# EAGLE design main (EAGLE 9.5.2)
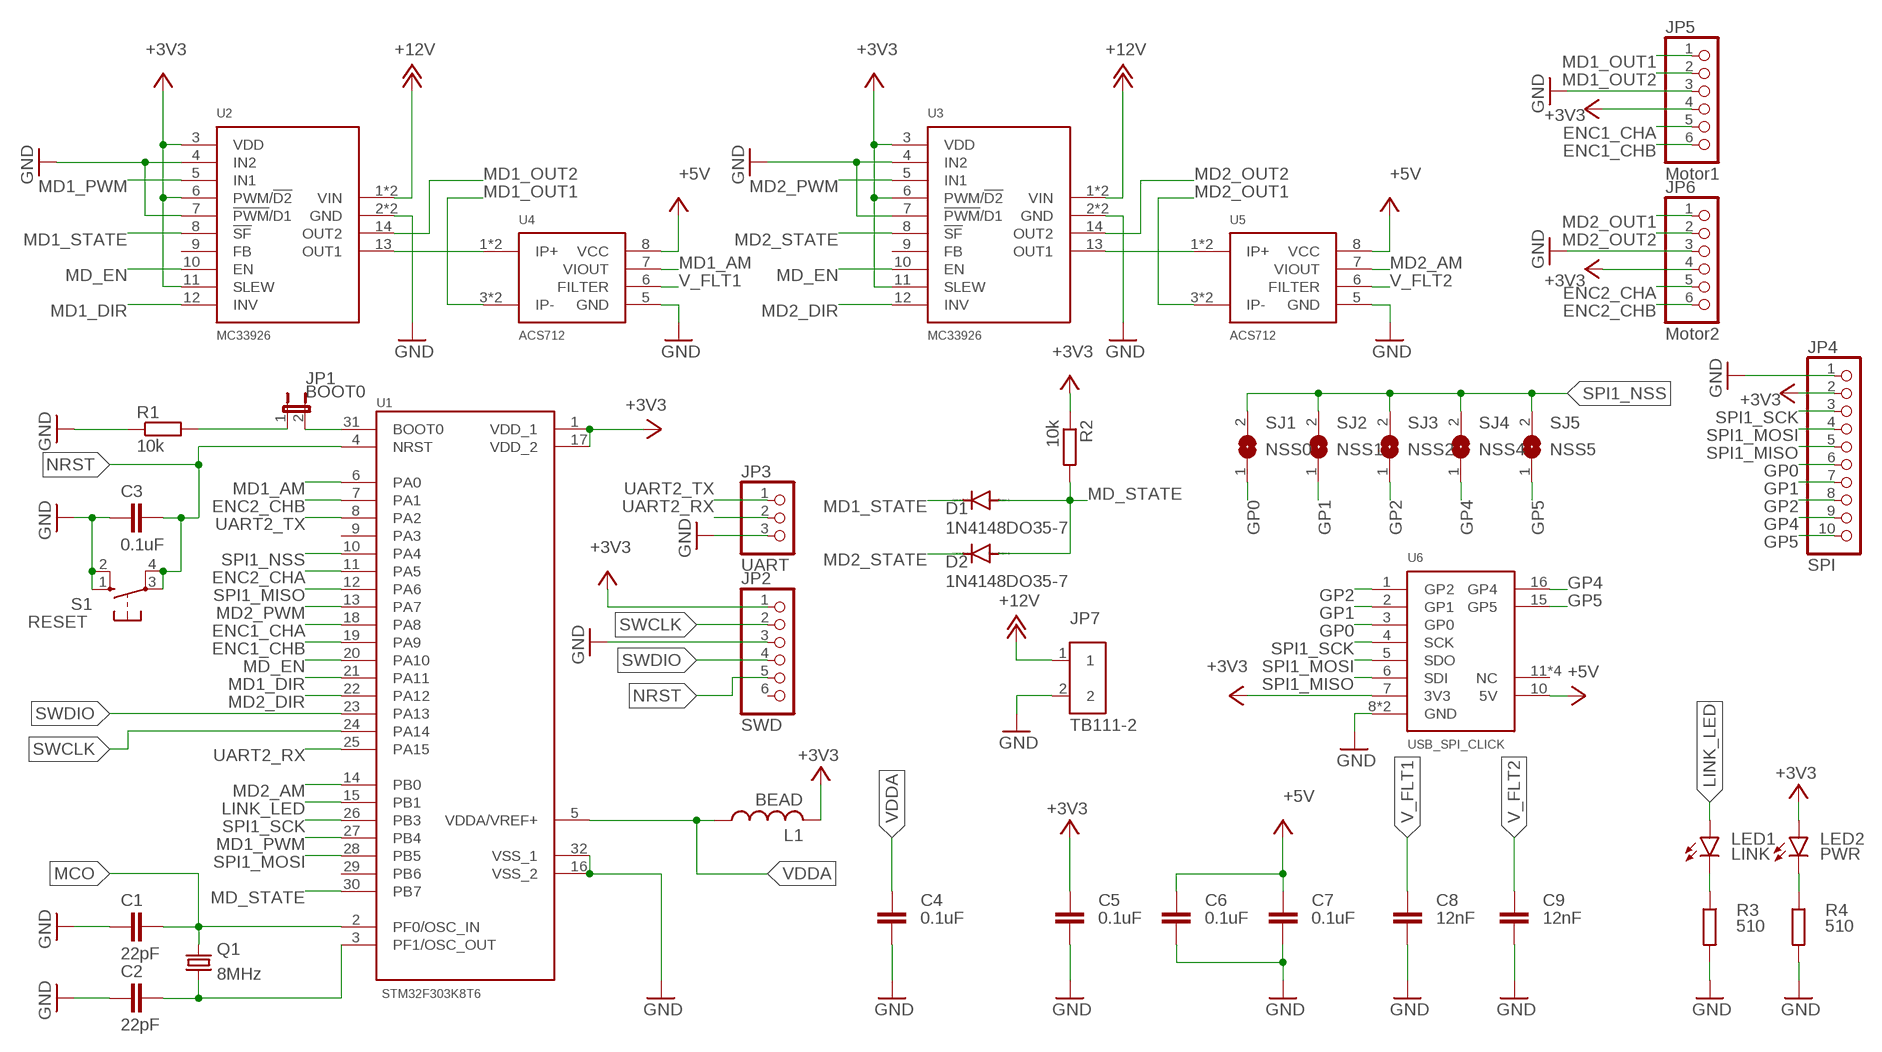
[diagram p0: schematic, sheet 1]

## Parts
C1  22pF  C-EUC1608  [C1608]
C2  22pF  C-EUC1608  [C1608]
C3  0.1uF  C-EUC1608  [C1608]
C4  0.1uF  C-EUC1608  [C1608]
C5  0.1uF  C-EUC1608  [C1608]
C6  0.1uF  C-EUC1608  [C1608]
C7  0.1uF  C-EUC1608  [C1608]
C8  12nF  C-EUC1608  [C1608]
C9  12nF  C-EUC1608  [C1608]
D1  1N4148DO35-7  [DO35-7]
D2  1N4148DO35-7  [DO35-7]
JP1  BOOT0  JP1E  [JP1]
JP2  SWD  PINHD-1X6  [1X06]
JP3  UART  PINHD-1X3  [1X03]
JP4  SPI  PINHD-1X10  [1X10]
JP5  Motor1  PINHD-1X6/90  [1X06/90]
JP6  Motor2  PINHD-1X6/90  [1X06/90]
JP7  TB111-2  P-01306_TB111-2-2-U-1-1  [TB111-2-2-U-1-1]
L1  BEAD  L-USL2012C  [L2012C]
LED1  LINK  LED3MM  [LED3MM]
LED2  PWR  LED3MM  [LED3MM]
Q1  8MHz  CRYSTALHC49S  [HC49/S]
R1  10k  R-EU_R1210  [R1210]
R2  10k  R-EU_R1210  [R1210]
R3  510  R-EU_R1210  [R1210]
R4  510  R-EU_R1210  [R1210]
S1  RESET  10-XX  [B3F-10XX]
SJ1  NSS0  SJ  [SJ]
SJ2  NSS1  SJ  [SJ]
SJ3  NSS2  SJ  [SJ]
SJ4  NSS4  SJ  [SJ]
SJ5  NSS5  SJ  [SJ]
U1  STM32F303K8T6  [QFP80P900X900X160-32N]
U2  MC33926  [SINGLE]
U3  MC33926  [SINGLE]
U4  ACS712  [SOIC8]
U5  ACS712  [SOIC8]
U6  USB_SPI_CLICK  [MIKROBUS]

## Nets
+3V3 [+3v3]: C5.1 JP2.1 JP4.2 JP5.4 JP6.4 L1.2 LED2.A R2.1 U1.1(VDD_1) U1.17(VDD_2) U2.3(VDD) U2.6(PWM/!D2!) U2.11(SLEW) U3.3(VDD) U3.6(PWM/!D2!) U3.11(SLEW) U6.7(3V3)
+5V [+5v]: C6.1 C7.1 U4.8(VCC) U5.8(VCC) U6.10(5V)
+12V [+12v]: JP7.1 U2.1(VIN) U2.16(VIN) U3.1(VIN) U3.16(VIN)
ENC1_CHA: JP5.5 U1.18(PA8)
ENC1_CHB: JP5.6 U1.19(PA9)
ENC2_CHA: JP6.5 U1.11(PA5)
ENC2_CHB: JP6.6 U1.7(PA1)
GND [gnd]: C1.2 C2.2 C3.1 C4.2 C5.2 C6.2 C7.2 C8.2 C9.2 JP2.3 JP3.3 JP4.1 JP5.3 JP6.3 JP7.2 R1.1 R3.2 R4.2 S1.1(S) S1.2(S1) U1.16(VSS_2) U1.32(VSS_1) U2.2(GND) U2.4(IN2) U2.7(!PWM!/D1) U2.15(GND) U3.2(GND) U3.4(IN2) U3.7(!PWM!/D1) U3.15(GND) U4.5(GND) U5.5(GND) U6.8(GND) U6.9(GND)
GP0: JP4.6 SJ1.1 U6.3(GP0)
GP1: JP4.7 SJ2.1 U6.2(GP1)
GP2: JP4.8 SJ3.1 U6.1(GP2)
GP4: JP4.9 SJ4.1 U6.16(GP4)
GP5: JP4.10 SJ5.1 U6.15(GP5)
LINK_LED: LED1.A U1.15(PB1)
MCO [clock]: C1.1 Q1.2 U1.2(PF0/OSC_IN)
MD1_AM [analog]: U1.6(PA0) U4.7(VIOUT)
MD1_DIR: U1.21(PA11) U2.12(INV)
MD1_OUT1 [+12v]: JP5.1 U4.3(IP-) U4.4(IP-)
MD1_OUT2 [+12v]: JP5.2 U2.14(OUT2)
MD1_PWM: U1.27(PB4) U2.5(IN1)
MD1_STATE: D1.C U2.8(!SF!)
MD2_AM [analog]: U1.14(PB0) U5.7(VIOUT)
MD2_DIR: U1.22(PA12) U3.12(INV)
MD2_OUT1 [+12v]: JP6.1 U5.3(IP-) U5.4(IP-)
MD2_OUT2 [+12v]: JP6.2 U3.14(OUT2)
MD2_PWM: U1.13(PA7) U3.5(IN1)
MD2_STATE: D2.C U3.8(!SF!)
MD_EN: U1.20(PA10) U2.10(EN) U3.10(EN)
MD_STATE: D1.A D2.A R2.2 U1.30(PB7)
N$1: JP1.2 U1.31(BOOT0)
N$2 [clock]: C2.1 Q1.1 U1.3(PF1/OSC_OUT)
N$3: JP1.1 R1.2
N$4 [+12v]: U2.13(OUT1) U4.1(IP+) U4.2(IP+)
N$5 [+12v]: U3.13(OUT1) U5.1(IP+) U5.2(IP+)
N$11: LED1.K(C) R3.1
N$12: LED2.K(C) R4.1
NRST: C3.2 JP2.5 S1.3(P) S1.4(P1) U1.4(NRST)
SPI1_MISO: JP4.5 U1.12(PA6) U6.6(SDI)
SPI1_MOSI: JP4.4 U1.28(PB5) U6.5(SDO)
SPI1_NSS: SJ1.2 SJ2.2 SJ3.2 SJ4.2 SJ5.2 U1.10(PA4)
SPI1_SCK: JP4.3 U1.26(PB3) U6.4(SCK)
SWCLK: JP2.2 U1.24(PA14)
SWDIO: JP2.4 U1.23(PA13)
UART2_RX: JP3.2 U1.25(PA15)
UART2_TX: JP3.1 U1.8(PA2)
V_FLT1: C8.1 U4.6(FILTER)
V_FLT2: C9.1 U5.6(FILTER)
VDDA [+3v3]: C4.1 L1.1 U1.5(VDDA/VREF+)
Unconnected: JP2.6 U1.9(PA3) U1.29(PB6) U2.9(FB) U3.9(FB) U6.11(NC) U6.12(NC) U6.13(NC) U6.14(NC)

## Library data of the parts
C1-C9 = rcl:C-EU: CAPACITOR, European symbol; SPICEPREFIX: C
D1 D2 = diode:1N4148: DIODE high speed (Philips)
JP1 = jumper:JP1E: JUMPER
JP2 JP5 JP6 = pinhead:PINHD-1X6: PIN HEADER
JP3 = pinhead:PINHD-1X3: PIN HEADER
JP4 = pinhead:PINHD-1X10: PIN HEADER
JP7 = Akizuki:P-01306_TB111-2-2-U-1-1
L1 = rcl:L-US: INDUCTOR, American symbol; SPICEPREFIX: L
LED1 LED2 = led:LED: LED OSRAM: - CHIPLED LG R971, LG N971, LY N971, LG Q971, LY Q971, LO R971, LY R971 LH N974, LH R974 LS Q976, LO Q976, LY Q976 LO Q996 - Hyper CHIPLED LW Q18S LB Q993, LB Q99A, LB R99A - SideLED LS A670, LO A670, LY A670, LG A670, LP A670 LB A673, LV A673, LT A673, LW A673 LH A674 LY A675 LS A676, LA A676, LO A676, LY A676, LW A676 LS A679, LY A679, LG A679 - Hyper Micro SIDELED® LS Y876, LA Y876, LO Y876, LY Y876 LT Y87S - SmartLED LW L88C, LW L88S LB L89C, LB L89S, LG L890 LS L89K, LO L89K, LY L89K LS L896, LA L896, LO L896, LY L896 - TOPLED LS T670, LO T670, LY T670, LG T670, LP T670 LSG T670, LSP T670, LSY T670, LOP T670, LYG T670 LG T671, LOG T671, LSG T671 LB T673, LV T673, LT T673, LW T673 LH T674 LS T676, LA T676, LO T676, LY T676, LB T676, LH T676, LSB T676, LW T676 LB T67C, LV T67C, LT T67C, LS T67K, LO T67K, LY T67K, LW E67C LS E67B, LA E67B, LO E67B, LY E67B, LB E67C, LV E67C, LT E67C LW T67C LS T679, LY T679, LG T679 LS T770, LO T770, LY T770, LG T770, LP T770 LB T773, LV T773, LT T773, LW T773 LH T774 LS E675, LA E675, LY E675, LS T675 LS T776, LA T776, LO T776, LY T776, LB T776 LHGB T686 LT T68C, LB T68C - Hyper Mini TOPLED® LB M676 - Mini TOPLED Santana® LG M470 LS M47K, LO M47K, LY M47K Source: http://www.osram.convergy.de LUXEON: - LUMILED® LXK2-PW12-R00, LXK2-PW12-S00, LXK2-PW14-U00, LXK2-PW14-V00 LXK2-PM12-R00, LXK2-PM12-S00, LXK2-PM14-U00 LXK2-PE12-Q00, LXK2-PE12-R00, LXK2-PE12-S00, LXK2-PE14-T00, LXK2-PE14-U00 LXK2-PB12-K00, LXK2-PB12-L00, LXK2-PB12-M00, LXK2-PB14-N00, LXK2-PB14-P00, LXK2-PB14-Q00 LXK2-PR12-L00, LXK2-PR12-M00, LXK2-PR14-Q00, LXK2-PR14-R00 LXK2-PD12-Q00, LXK2-PD12-R00, LXK2-PD12-S00 LXK2-PH12-R00, LXK2-PH12-S00 LXK2-PL12-P00, LXK2-PL12-Q00, LXK2-PL12-R00 Source: www.luxeon.com KINGBRIGHT: KA-3528ASYC Source: www.kingbright.com
Q1 = crystal:CRYSTAL: CRYSTAL; OC_FARNELL: 1667008; OC_NEWARK: unknown
R1-R4 = rcl:R-EU_: RESISTOR, European symbol; SPICEPREFIX: R
S1 = switch-omron:10-XX: OMRON SWITCH; MPN: B3F-1000; OC_FARNELL: 176432; OC_NEWARK: 36M3542
SJ1-SJ5 = jumper:SJ: SMD solder JUMPER
U1 = STM32F303K8T6:STM32F303K8T6: Analog and DSP with FPU ARM Cortex-M4 MCU with 64 Kbytes Flash, 72 MHz CPU, CCM, 12-bit ADC 5 MSPS, comparators, op-amp Check prices <https://pricing.snapeda.com/parts/STM32F303K8T6/STMicroelectronics/view-part?ref=eda>; AVAILABILITY: In Stock; DESCRIPTION: ARM® Cortex®-M4 STM32F3 Microcontroller IC 32-Bit 72MHz 64KB (64K x 8) FLASH 32-LQFP (7x7); MF: STMicroelectronics; MP: STM32F303K8T6; PACKAGE: LQFP-32 STMicroelectronics; PRICE: None; PURCHASE-URL: https://pricing.snapeda.com/search/part/STM32F303K8T6/?ref=eda
U2 U3 = pololu_mc33926:MC33926
U4 U5 = ACS712:ACS712
U6 = USB_SPI_Click:USB_SPI_CLICK

## Net classes
0 default: width 0.305 mm, drill 0.305 mm, clearance 0.178 mm
1 +5v: width 0.381 mm, drill 0.381 mm, clearance 0.203 mm
2 +3v3: width 0.381 mm, drill 0.381 mm, clearance 0.203 mm
3 +12v: width 1.016 mm, drill 0.889 mm, clearance 0.229 mm
4 analog: width 0.305 mm, drill 0.305 mm, clearance 0.203 mm
5 clock: width 0.305 mm, drill 0.305 mm, clearance 0.203 mm
6 gnd: width 0.406 mm, drill 0.406 mm

## Board
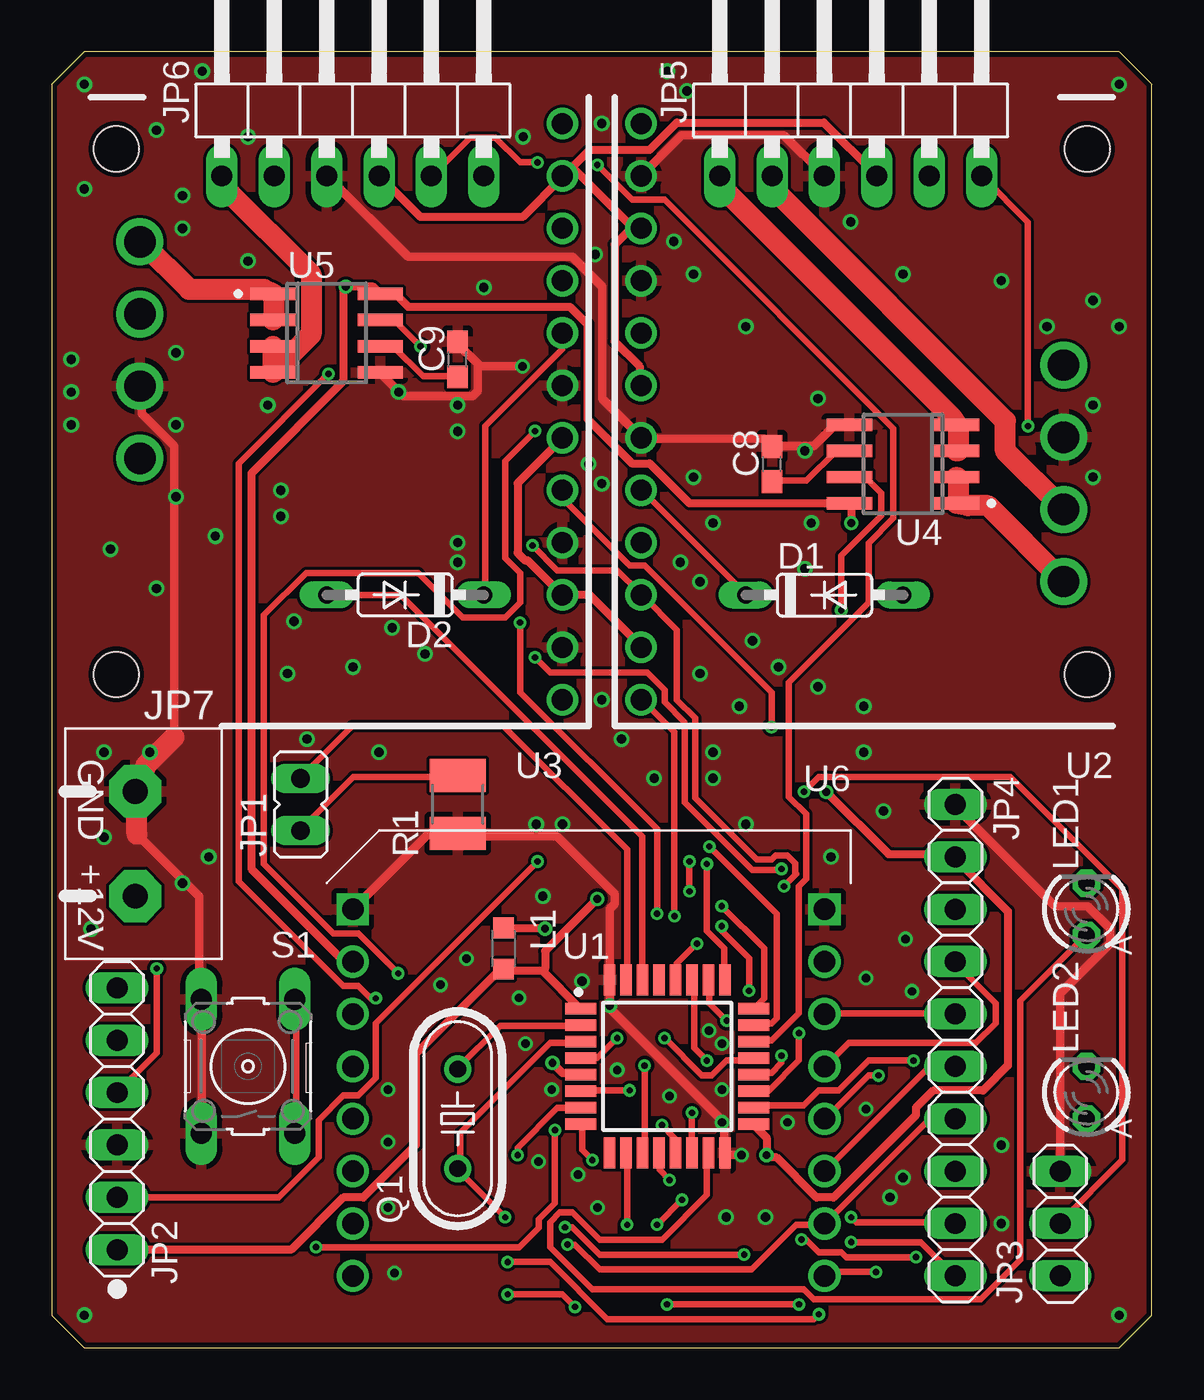
[diagram p1: board, top side]
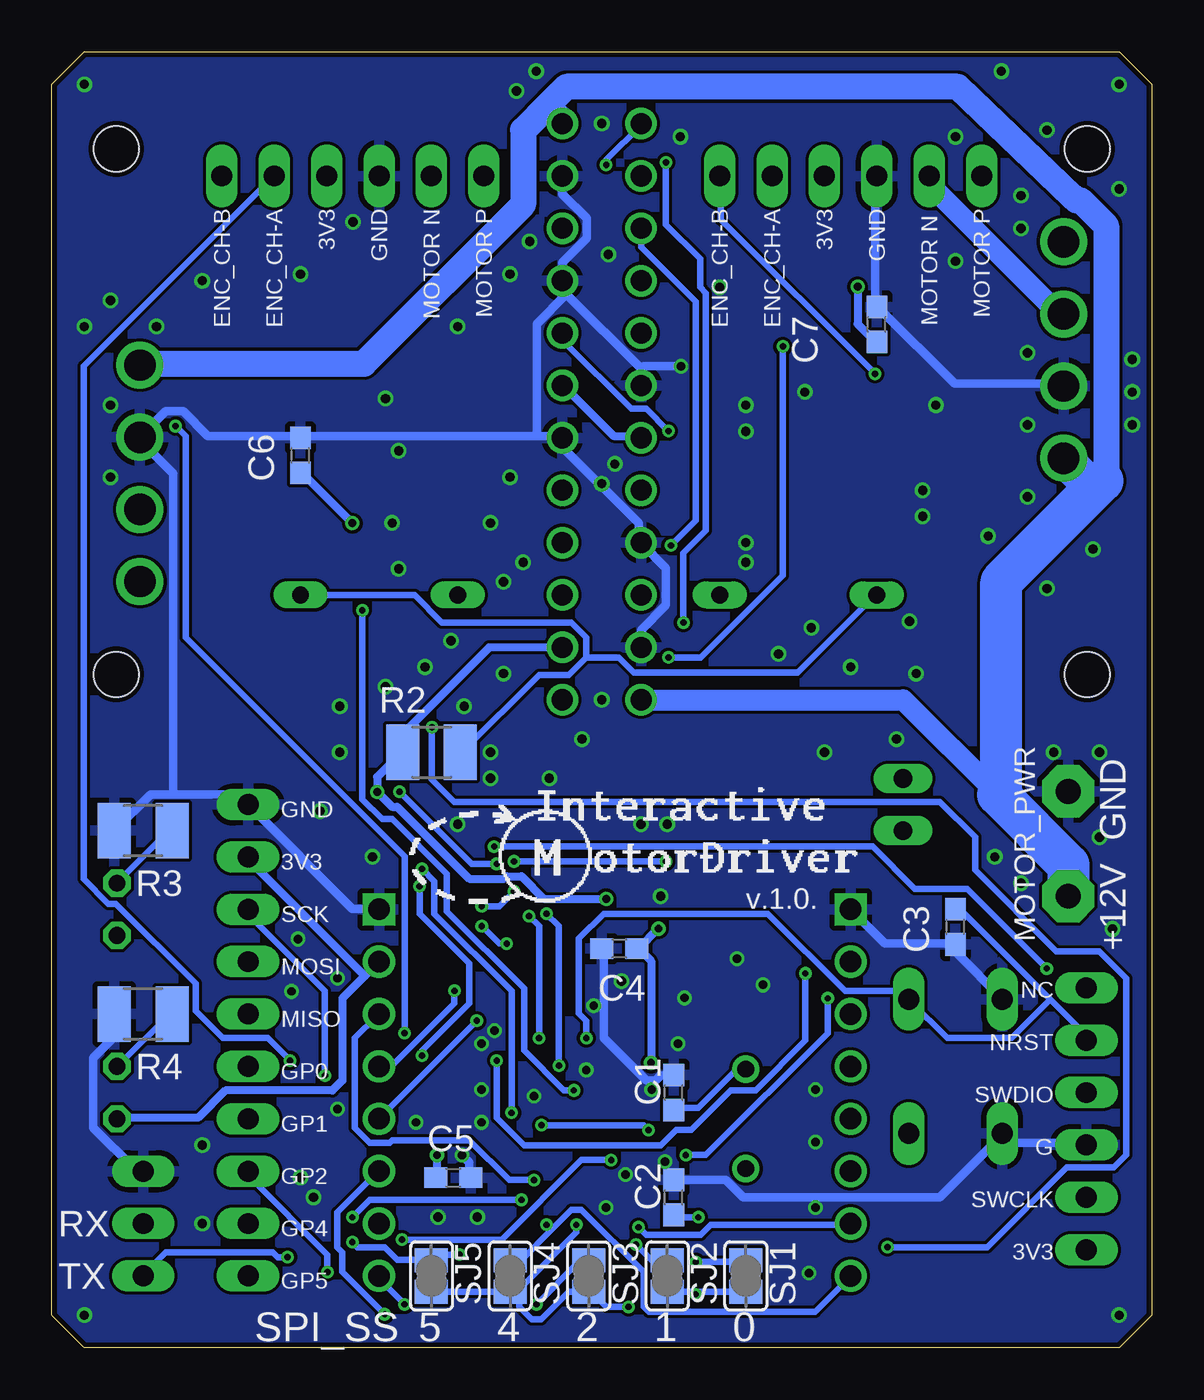
[diagram p2: board, bottom side, seen from below]

Size 53.34 x 62.86 mm. Coordinates in mm from the lower left corner, seen from the top.
Outline: 1.59,0 51.75,0 53.34,1.59 53.34,61.28 51.75,62.86 1.59,62.86 0,61.28 0,1.59 1.59,0
Copper layers (1*16): Top 0.035mm / dielectric 1.5mm / Bottom 0.035mm
Design rules "ssci_SeeedStudio_2layer_DRU_no_angle": minimum track width 6mil, minimum drill 12mil, track to track 6mil, track to pad 6mil, pad to pad 6mil, via to via 6mil, smd to smd 0mil, copper to edge 10mil, drill to drill 10mil, minimum pad ring 10mil, minimum via ring 6mil, stop-mask expansion 2mil, vias tented up to drill 25mil, thermal gap 10mil

### Footprints (pad centres in the part's own frame; a part is rotated, then mirrored left to right if it is on the bottom)
C1608 = smd 1.1 x 1: 1 -0.85,0; 2 0.85,0
DO35-7 = drill 0.813 long: A 3.81,0; C -3.81,0
JP1 = drill 0.914 long: 1 0,-1.27; 2 0,1.27
1X06 = drill 1.016 long: 1 -6.35,0; 2 -3.81,0; 3 -1.27,0; 4 1.27,0; 5 3.81,0; 6 6.35,0
1X03 = drill 1.016 long: 1 -2.54,0; 2 0,0; 3 2.54,0
1X10 = drill 1.016 long: 1 -11.43,0; 2 -8.89,0; 3 -6.35,0; 4 -3.81,0; 5 -1.27,0; 6 1.27,0; 7 3.81,0; 8 6.35,0; 9 8.89,0; 10 11.43,0
1X06/90 = drill 1.016 long: 1 -6.35,-3.81; 2 -3.81,-3.81; 3 -1.27,-3.81; 4 1.27,-3.81; 5 3.81,-3.81; 6 6.35,-3.81
TB111-2-2-U-1-1 = drill 1.2 pad 2.54 octagon: 1 0,4.2; 2 5.08,4.2
L2012C = smd 1 x 1: 1 -1,0; 2 1,0
LED3MM = drill 0.813 octagon: A -1.27,0; K 1.27,0
HC49/S = drill 0.813: 1 -2.413,0; 2 2.413,0
R1210 = smd 1.6 x 2.7: 1 -1.4,0; 2 1.4,0
B3F-10XX = drill 1.016 long: 1 -3.251,2.261; 2 3.251,2.261; 3 -3.251,-2.261; 4 3.251,-2.261
SJ = smd 1.168 x 1.6: 1 -0.762,0; 2 0.762,0
QFP80P900X900X160-32N = smd 1.5 x 0.55: 1 -4.2,2.8; 2 -4.2,2; 3 -4.2,1.2; 4 -4.2,0.4; 5 -4.2,-0.4; 6 -4.2,-1.2; 7 -4.2,-2; 8 -4.2,-2.8; 17 4.2,-2.8; 18 4.2,-2; 19 4.2,-1.2; 20 4.2,-0.4; 21 4.2,0.4; 22 4.2,1.2; 23 4.2,2; 24 4.2,2.8 | smd 0.55 x 1.5: 9 -2.8,-4.2; 10 -2,-4.2; 11 -1.2,-4.2; 12 -0.4,-4.2; 13 0.4,-4.2; 14 1.2,-4.2; 15 2,-4.2; 16 2.8,-4.2; 25 2.8,4.2; 26 2,4.2; 27 1.2,4.2; 28 0.4,4.2; 29 -0.4,4.2; 30 -1.2,4.2; 31 -2,4.2; 32 -2.8,4.2
SINGLE = drill 1.02: 1 1.27,29.21; 2 1.27,26.67; 3 1.27,24.13; 4 1.27,21.59; 5 1.27,19.05; 6 1.27,16.51; 7 1.27,13.97; 8 1.27,11.43; 9 1.27,8.89; 10 1.27,6.35; 11 1.27,3.81; 12 1.27,1.27 | drill 1.52: 13 21.75,7; 14 21.75,10.5; 15 21.75,14; 16 21.75,17.5 | hole 2.18: 22.9,27.98; 22.9,2.5
SOIC8 = smd 0.6 x 2.2: 1 -1.905,-2.6; 2 -0.635,-2.6; 3 0.635,-2.6; 4 1.905,-2.6; 5 1.905,2.6; 6 0.635,2.6; 7 -0.635,2.6; 8 -1.905,2.6
MIKROBUS = drill 1.04: 1 0,17.78; 2 0,15.24; 3 0,12.7; 4 0,10.16; 5 0,7.62; 6 0,5.08; 7 0,2.54; 10 22.86,2.54; 11 22.86,5.08; 12 22.86,7.62; 13 22.86,10.16; 14 22.86,12.7; 15 22.86,15.24; 16 22.86,17.78 | drill 1.04 square: 8 0,0; 9 22.86,0

### Placement (x,y rotation side)
C1  23.18,12.38 90 bottom
C2  23.18,7.3 90 bottom
C3  9.53,20.42 90 bottom
C4  25.82,19.37 180 bottom
C5  33.87,8.25 0 bottom
C6  41.27,43.28 90 bottom
C7  13.33,49.63 90 bottom
C8  34.92,42.86 90 top
C9  19.69,47.94 90 top
D1  37.46,36.51 0 top
D2  17.15,36.51 180 top
JP1  12.06,26.35 0 top
JP2  3.17,11.11 90 top
JP3  48.89,6.03 90 top
JP4  43.81,14.92 270 top
JP5  38.73,60.64 0 top
JP6  14.61,60.64 0 top
JP7  8.26,21.91 90 top
L1  21.91,19.37 270 top
LED1  50.16,21.27 90 top
LED2  50.16,12.38 90 top
Q1  19.69,11.11 90 top
R1  19.69,26.35 90 top
R2  34.92,28.89 0 bottom
R3  48.89,25.08 180 bottom
R4  48.89,16.19 180 bottom
S1  9.53,13.65 90 top
SJ1  19.69,3.49 270 bottom
SJ2  23.5,3.49 270 bottom
SJ3  27.31,3.49 270 bottom
SJ4  31.12,3.49 270 bottom
SJ5  34.92,3.49 270 bottom
U1  29.85,13.65 0 top
U2  27.31,30.16 0 top
U3  26.04,60.64 180 top
U4  41.27,42.86 90 top
U5  13.33,49.21 270 top
U6  37.46,21.27 180 top
U$1  [LOGO_A_X3]  36.2,21.27 0 bottom

### Tracks (layer width: path | path; a pad name or v marks a point on that pad's centre or on a via)
+3V3  (via drill 0.38)
  Top 0.381: 23.8,18.28 21.99,18.28 L1.2 21.76,18.37 17.66,14.27 17.66,9.85 15.11,7.3 14.15,7.3 11.61,4.77 3.29,4.77 JP2.1 | 23.8,18.28 25.61,16.47 U1.1 | U1.17 34.05,10.8 34.66,10.2 v34.66,9.35 34.78,9.23 35.14,9.23 37.07,7.3 37.92,7.3 41.9,11.28 41.9,11.65 42.74,12.49 45.16,12.49 46.36,13.7 46.36,21.18 43.83,23.71 JP4.2 43.71,23.95 40.57,23.95 v37.55,26.97 | U2.11 28.51,34.09 26.09,36.5 24.77,36.5 U3.3 24.64,36.62 23.08,38.19 22.96,38.19 22.59,38.55 22.59,41.93 24.77,44.1 U3.6 | JP6.4 15.96,56.77 17.89,54.84 22.84,54.84 24.77,56.77 U3.11 | JP5.4 39.97,56.89 37.43,59.42 30.32,59.42 28.99,58.1 26.09,58.1 24.89,56.89 U3.11 | U3.11 25.37,57.13 28.14,54.36 28.51,54.36 U2.3 28.02,54.24 27.3,53.51 27.3,48.81 28.51,47.6 28.51,46.76 U2.6 | v26.45,21.78 23.92,19.25 23.92,18.4 23.8,18.28
  Bottom 0.381: U6.7 38.16,18.04 | 38.16,18.04 39.24,16.95 39.24,12.97 39.73,12.49 44.91,12.49 46.24,11.16 50.1,11.16 LED2.A | v34.66,9.35 34.66,8.27 C5.1 | 38.16,18.04 43.83,23.71 JP4.2 | U2.11 28.63,33.97 32.12,33.97 36.23,29.86 36.23,28.9 R2.1 36.47,28.78 37.55,27.69 v37.55,26.97 36.83,26.24 36.59,26.24 33.09,22.75 31.4,22.75 31.28,22.87 30.56,22.87 29.47,21.78 v26.45,21.78 | U3.6 24.77,44.22 26.09,44.22 28.51,46.63 U2.6
+5V  (via drill 0.38)
  Top 0.381: v38.76,40 38.76,40.84 U4.8 38.52,40.96 30.92,40.96 28.99,42.89 28.14,42.89 25.97,45.07 25.97,49.65 25.13,50.5 17.29,50.5 16.68,51.1 16.08,51.1 U5.8 15.84,51.22 15.6,51.46 v14.27,51.46 14.15,51.34 14.15,46.88 9.68,42.41 9.68,23.23 14.15,18.76 14.51,18.76 U6.10
  Bottom 0.381: v38.76,40 41.17,42.41 C6.1 | v14.27,51.46 14.27,49.65 13.42,48.81 C7.1
+12V
  Bottom 1.016: 49.02,47.72 U2.16 | U3.1 12.06,31.43 7.46,26.83 7.3,26.99 | U2.1 28.58,59.69 29.21,60.33 | 2.41,42.05 3.2,42.05
  Bottom 1.27: 49.02,47.72 38.2,47.72 30.48,55.44 30.48,59.05 29.21,60.33 28.39,61.15 9.4,61.15 3.85,55.84 3.66,55.65 3.46,55.65 2.22,54.41 2.22,42.23 2.4,42.05 3.2,42.05
  Bottom 1.778: 3.2,42.05 U3.16
  Bottom 2.032: 7.46,26.83 4.05,23.42 JP7.1 | 2.41,42.05 7.3,37.16 7.3,26.99
ENC1_CHA  (via drill 0.3)
  Top 0.305: v41.78,13.94 39.6,13.94 38.16,12.49 37.19,12.49 36.47,11.77 34.05,11.77 U1.18
  Bottom 0.305: v41.78,13.94 42.86,15.02 45.03,15.02 46.36,16.35 46.36,17.68 50.22,21.54 50.58,21.54 51.79,22.75 51.79,47.6 42.62,56.77 JP5.5
ENC1_CHB  (via drill 0.3)
  Top 0.305: v36.23,15.27 36.23,13.94 34.78,12.49 34.05,12.49 U1.19 | v47.33,44.7 47.33,54.6 45.16,56.77 JP5.6
  Bottom 0.305: v36.23,15.27 36.23,23.83 46.84,34.45 46.84,44.22 v47.33,44.7
ENC2_CHA  (via drill 0.3)
  Top 0.305: v28.75,13.7 28.75,9.47 U1.11 | v29.35,21.06 29.35,25.16 22.71,31.79 v22.71,35.17 | v23.56,57.49 22.71,57.49 21.51,58.7 20.3,58.7 18.49,56.89 JP6.5
  Bottom 0.305: v28.75,13.7 28.75,20.45 v29.35,21.06 | v22.71,35.17 22.71,38.55 21.63,39.64 21.63,51.16 21.91,51.44 21.91,52.83 23.56,54.48 v23.56,57.49
ENC2_CHB  (via drill 0.3)
  Top 0.305: v22.59,9.35 22.59,9.72 24.52,11.65 25.61,11.65 U1.7 | v15.72,16.95 15.47,16.95 14.87,17.56 14.15,17.56 9.08,22.63 9.08,42.89 v13.42,47.24
  Bottom 0.305: v22.59,9.35 21.63,9.35 15.72,15.27 v15.72,16.95 | v13.42,47.24 20.9,54.72 20.9,56.77 JP6.6
GND  (via drill 0.41, 0.45)
  Top 0.406: v33.45,9.35 32.73,9.35 U1.16 32.61,9.59 32.61,10.92 27.06,16.47 v27.06,16.59 27.06,17.8 U1.32 27.06,18.04 27.06,21.3 27.3,21.54 27.3,22.02 24.52,24.8 19.82,24.8 R1.1 19.58,24.92 18.25,24.92 U6.9 | 4.13,24.92 7.15,21.9 7.15,16.95 S1.2 7.27,16.71 7.27,10.44 S1.1 | 4.13,26.94 JP7.2 | 5.94,29.62 5.94,43.74 4.38,45.31 4.38,46.63 U3.15 | JP5.3 37.43,56.89 35.5,58.82 30.56,58.82 28.63,56.89 U2.2 | 20.66,47.72 19.7,48.69 C9.2 | 20.66,47.72 20.66,46.39 20.42,46.15 17.04,46.15 15.96,47.24 U5.5 | v22.84,47.6 20.78,47.6 20.66,47.72 | JP3.3 48.89,17.2 51.31,19.61 51.31,20.33 50.22,21.42 48.65,21.42 43.83,26.24 JP4.1 | U4.5 38.64,44.7 37.92,44.7 36.95,43.74 35.02,43.74 C8.2 34.78,43.86 34.54,44.1 28.63,44.1 U2.7 28.51,44.22 26.7,46.03 26.7,51.46 25.25,52.91 17.29,52.91 13.42,56.77 JP6.3
  Top 1.016: 5.94,29.62 4.58,28.26 JP7.2 | 4.13,24.92 4.13,26.94
  Bottom 0.406: JP6.3 13.42,56.77 13.42,50.5 C7.2 13.18,50.37 9.56,46.76 4.38,46.76 U3.15 | C2.2 23.08,8.15 20.66,8.15 19.82,7.3 10.29,7.3 7.27,10.32 S1.1 7.15,10.2 6.91,9.96 3.29,9.96 JP2.3 | 26.58,16.59 26.58,19.37 C4.2 | 26.58,16.59 26.58,15.02 24.52,12.97 24.04,12.97 23.8,13.21 23.2,13.21 C1.2 | v33.45,9.35 33.09,8.99 33.09,8.27 C5.2 | v27.06,16.59 26.58,16.59 | S1.2 7.27,16.95 9.44,19.13 9.44,19.49 C3.1 9.68,19.61 12.94,19.61 U6.9 | 24.77,47.48 U3.7 | 28.39,51.1 28.51,51.22 28.51,51.7 U2.4 28.58,52.64 27.4,53.81 27.4,54.78 28.58,55.95 U2.2 | 28.39,51.1 24.77,47.48 | v22.84,47.6 24.64,47.6 24.77,47.48 | R4.2 50.34,16.11 50.34,15.02 51.31,14.06 51.31,10.68 49.26,8.63 48.89,8.63 JP3.3 | 47.45,26.85 44.31,26.85 JP4.1 38.76,21.3 37.55,21.3 U6.8 | 47.45,26.85 48.53,26.85 50.22,25.16 R3.2 | U3.2 24.77,34.81 23.56,36.02 23.56,37.83 24.77,39.03 U3.4 24.89,39.15 24.89,40 28.51,43.62 28.51,44.1 U2.7 28.75,44.22 29.83,44.22 | 29.83,44.22 41.17,44.22 C6.2 41.29,44.22 45.76,44.22 46.96,45.43 47.81,45.43 49.02,44.22 U2.15 49.02,43.98 47.45,42.41 47.45,26.85 | 28.39,51.1 29.83,49.65 29.83,44.22
  other vias: 11.11,40.32 11.11,41.59 16.83,46.35 19.69,38.1 20.96,51.44 19.69,39.05 19.69,45.72 19.69,44.45 26.04,42.86 26.67,41.91 30.48,38.1 31.43,37.15 32.07,40.01 36.83,40.01 36.51,37.78 37.15,32.07 33.97,34.29 35.24,33.02 14.61,33.02 16.51,34.92 15.88,28.89 39.37,28.89 46.04,6.03 46.04,9.84 40.64,7.3 41.27,8.25 34.61,6.35 32.7,6.35 25.51,8.4 26.47,6.81 16.31,6.81 22.97,14.75 16.31,12.53 16.31,9.99 22.66,16.97 18.85,17.61 20.12,18.88 24.24,12.53 26.67,31.43 29.21,27.62 27.62,29.53 1.59,61.28 51.75,61.28 51.75,1.59 1.59,1.59 46.04,51.75 48.26,49.53 26.35,53.02 10.48,45.72 9.53,52.7 23.61,9.04 6.35,22.54 1.91,20.32 7.62,23.81 32.07,28.89 32.07,27.62 33.66,25.4 31.43,32.7 33.34,31.12 24.77,25.4 23.5,25.4 11.75,35.24 18.1,33.66 39.37,31.12 40.32,26.03 37.78,23.81 23.81,21.91 25.72,17.78 27.42,13.48 29.96,12.21 32.5,10.94 32.5,12.53 31.86,15.39 32.5,14.75 35.67,10.94 39.48,11.58 41.71,17.29 39.48,17.93 41.39,19.83 16.62,3.64 2.54,24.77 2.54,28.89 6.03,41.27 7.94,39.37 2.86,38.73 5.08,36.83 0.95,44.77 6.35,54.29 6.35,55.88 5.08,59.05 1.59,56.2 9.53,58.74 22.86,58.74 29.85,61.91 7.3,61.91 36.51,43.5 31.12,42.23 37.15,46.04 30.16,53.66 26.67,59.37 30.8,60.96 4.76,28.89 12.38,29.53 11.43,32.7 0.95,47.94 0.95,46.35 6.03,48.26 6.03,44.77 50.48,45.72 50.48,42.23 51.75,49.53 50.48,50.8 38.73,54.61 33.66,49.53 31.12,52.07 41.27,52.07
  pour Top: -0.64,64.45 53.98,64.45 53.98,-0.32 -0.64,-0.32
  pour Bottom: -0.64,64.45 53.98,64.45 53.98,-0.32 -0.64,-0.32
GP0  (via drill 0.3)
  Top 0.305: v22.11,4.17 24.16,4.17 26.94,1.39 36.95,1.39 v37.19,1.63 | JP4.6 43.71,13.58 42.5,13.58 37.55,8.63 U6.3
  Bottom 0.305: v22.11,4.17 19.7,4.17 SJ1.1 | v37.19,1.63 39.24,3.68 39.24,4.65 39.48,4.89 39.48,6.58 37.55,8.51 U6.3
GP1  (via drill 0.3)
  Top 0.305: v25.01,5.01 25.37,5.01 26.58,3.8 33.93,3.8 36.11,5.98 37.43,5.98 U6.2 37.55,6.1 42.5,11.04 43.71,11.04 JP4.7
  Bottom 0.305: v25.01,5.01 24.28,4.29 23.56,4.29 SJ2.1
GP2  (via drill 0.3)
  Top 0.305: v36.23,2.11 v29.83,2.11 | v39.97,3.68 37.67,3.68 37.55,3.56 U6.1
  Bottom 0.305: v29.83,2.11 27.78,4.17 27.42,4.17 SJ3.1 | v36.23,2.11 37.55,3.44 U6.1 | v39.97,3.68 39.97,4.53 43.71,8.27 43.71,8.51 JP4.8
GP4  (via drill 0.3)
  Top 0.305: v38.76,6.34 39,6.1 43.71,6.1 JP4.9 | v29.35,5.98 v30.56,7.18
  Bottom 0.305: 29.11,5.73 28.14,6.7 27.66,6.7 24.64,3.68 24.64,1.99 24.4,1.75 16.32,1.75 14.63,3.44 U6.16 | 29.11,5.73 30.56,4.29 31.04,4.29 SJ4.1 | v38.76,6.34 37.92,7.18 v30.56,7.18 | 29.11,5.73 v29.35,5.98
GP5  (via drill 0.3)
  Top 0.305: v38.76,5.13 42.14,5.13 43.71,3.56 JP4.10 | v24.89,5.85 25.25,5.85 26.58,4.53 v33.57,4.53
  Bottom 0.305: v38.76,5.13 38.52,4.89 37.19,4.89 36.59,4.29 35.02,4.29 SJ5.1 34.78,4.29 34.54,4.53 v33.57,4.53 | v24.89,5.85 24.52,5.49 21.87,5.49 21.39,5.98 14.63,5.98 U6.15
LINK_LED
  Top 0.305: U1.15 31.76,9.35 31.76,7.42 29.59,5.25 26.58,5.25 25.25,6.58 24.64,6.58 24.16,6.1 24.16,4.89 26.21,2.84 36.47,2.84 36.95,2.36 45.03,2.36 46.96,4.29 46.96,16.83 50.1,19.97 LED1.A
MCO
  Top 0.305: U1.2 25.61,15.63 21.75,15.63 19.7,13.58 Q1.2
  Bottom 0.305: C1.1 23.08,11.65 21.99,11.65 20.18,13.46 19.7,13.46 Q1.2
MD1_AM  (via drill 0.3)
  Top 0.305: v28.02,12.49 25.73,12.49 U1.6 | v38.28,35.78 38.28,38.43 40.21,40.36 40.21,41.45 39.48,42.17 38.76,42.17 U4.7
  Bottom 0.305: v28.02,12.49 28.51,12.49 30.44,14.42 30.44,17.44 34.18,21.18 34.18,22.99 36.83,25.64 37.31,25.64 38.28,26.61 v38.28,35.78
MD1_DIR  (via drill 0.3)
  Top 0.305: v29.71,15.02 31.52,13.21 32,13.21 32.73,13.94 33.93,13.94 U1.21 | v30.19,20.94 30.19,29.86 28.63,31.43 U2.12
  Bottom 0.305: v29.71,15.02 29.71,20.45 v30.19,20.94
MD1_OUT1
  Top 1.016: U4.3 43.95,43.5 43.95,44.7 U4.4 43.59,45.19 32.49,56.29 32.49,56.77 JP5.1
MD1_OUT2
  Top 1.016: JP5.2 35.02,56.77 35.02,56.17 46.24,44.95 46.24,43.5 49.02,40.72 U2.14
MD1_PWM  (via drill 0.3)
  Top 0.305: v31.76,13.94 31.16,14.54 31.16,17.8 U1.27 | v16.8,18.16 14.87,20.09 13.66,20.09 10.29,23.47 10.29,35.53 12.34,37.59 17.77,37.59 19.94,35.41 21.99,35.41 22.71,36.14 22.71,37.59 21.99,38.31 21.99,43.01 v23.44,44.46
  Bottom 0.305: v31.76,13.94 31.76,11.16 30.44,9.84 23.81,9.84 23.07,10.58 22.33,10.58 20.42,12.49 19.21,12.49 16.8,14.9 v16.8,18.16 | v23.44,44.46 24.52,45.55 25.25,45.55 28.51,48.81 28.51,49.17 U2.5
MD1_STATE
  Top 0.305: D1.C 33.57,36.62 28.63,41.57 U2.8
MD2_AM  (via drill 0.3)
  Top 0.305: v31.04,11.4 31.04,9.47 U1.14 | v23.44,33.48 24.16,32.76 28.87,32.76 29.71,31.92 29.71,31.31 30.67,30.35 30.67,30.11 30.7,30.07 30.7,26.45 33.97,23.18 35.33,23.18 v35.38,23.23 | v17.89,48.56 16.68,49.77 15.96,49.77 U5.7
  Bottom 0.305: v31.04,11.4 31.04,17.32 34.78,21.06 34.78,22.63 v35.38,23.23 | v23.44,33.48 21.87,33.48 17.89,37.46 v17.89,48.56
MD2_DIR  (via drill 0.3)
  Top 0.305: v26.45,57.37 28.14,55.68 29.71,55.68 40.81,44.58 40.81,40.24 39.6,39.03 39.6,36.14 35.74,32.28 35.74,26.73 36.59,25.88 36.59,22.75 36.23,22.38 36.23,16.23 34.9,14.9 34.05,14.9 U1.22
  Bottom 0.305: v26.45,57.37 26.45,57.61 24.77,59.3 U3.12
MD2_OUT1
  Top 1.016: JP6.1 8.36,56.77 8.36,56.29 12.58,52.06 12.58,49.15 U5.4 U5.3
MD2_OUT2
  Bottom 1.016: JP6.2 10.77,56.77 10.77,56.41 4.62,50.25 4.38,50.25 U3.14
MD2_PWM  (via drill 0.3)
  Top 0.305: v29.59,10.8 30.19,10.2 30.19,9.47 U1.13 | v34.9,30.11 34.9,31.79 28.75,37.95 28.02,37.95 24.77,41.21 U3.5 | v24.4,10.56 24.4,7.02 23.61,6.23 23.61,5.83 22.67,4.89 v12.82,4.89
  Bottom 0.305: v29.59,10.8 24.64,10.8 v24.4,10.56 | v12.82,4.89 8,4.89 4.13,8.75 1.84,8.75 1.24,9.35 1.24,17.92 2.55,19.23 4.63,19.23 8.58,23.17 8.58,24.77 10.29,26.49 33.81,26.49 34.9,27.57 v34.9,30.11
MD2_STATE
  Top 0.305: U3.8 24.77,48.44 21.03,44.7 21.03,36.62 D2.C
MD_EN  (via drill 0.3)
  Top 0.305: v35.38,14.18 35.38,13.82 34.9,13.34 34.05,13.34 U1.20 | v35.5,22.38 36.11,22.99 36.04,23.05 36.04,23.5 35.66,23.89 35.11,23.89 34.91,23.7 34.17,23.7 31.21,26.66 31.21,30.28 31.19,30.3 31.19,30.56 30.32,31.43 30.32,34.81 28.63,36.5 U2.10 28.51,36.62 27.42,37.71 24.52,37.71 v23.32,38.91
  Bottom 0.305: v35.38,14.18 35.38,14.42 33.09,16.71 33.09,18.64 35.5,21.06 v35.5,22.38 | U3.10 24.77,53.39 22.11,50.74 22.11,40.12 v23.32,38.91
MD_STATE
  Top 0.305: U1.30 28.63,17.92 28.63,24.8 16.93,36.5 13.42,36.5 D2.A
  Bottom 0.305: 27.42,33.48 27.42,34.45 28.14,35.17 34.42,35.17 35.74,36.5 41.17,36.5 D1.A | 27.42,33.48 28.26,32.64 29.71,32.64 33.45,28.9 R2.2 | 27.42,33.48 25.85,33.48 25.13,32.76 17.16,32.76 13.42,36.5 D2.A
N$1
  Top 0.305: U1.31 27.9,17.92 27.9,24.17 21.9,30.17 14.57,30.17 12.1,27.69 JP1.2
N$2  (via drill 0.3)
  Top 0.305: v21.99,6.34 19.7,8.63 Q1.1 19.82,8.75 19.82,10.44 24.16,14.78 25.61,14.78 U1.3
  Bottom 0.305: v21.99,6.34 23.08,6.34 C2.1
N$3
  Top 0.305: R1.2 19.58,27.69 14.63,27.69 12.1,25.16 JP1.1
N$4
  Top 1.016: U4.2 43.95,42.17 43.95,40.96 U4.1 44.43,40.84 45.4,40.84 49.02,37.22 U2.13
N$5
  Top 1.016: U5.2 10.77,49.89 10.77,51.1 U5.1 10.29,51.34 6.67,51.34 4.38,53.63 U3.13
N$11
  Bottom 0.305: LED1.K 50.1,22.63 47.57,25.16 R3.1
N$12
  Bottom 0.305: LED2.K 50.1,13.7 47.57,16.23 R4.1
NRST  (via drill 0.3)
  Top 0.305: v27.42,15.02 26.45,14.06 25.73,14.06 U1.4 | S1.3 11.86,10.44 11.86,16.83 S1.4
  Bottom 0.305: 4.92,16.89 3.29,15.27 3.29,15.02 JP2.5 | 4.92,16.89 9.2,21.18 9.44,21.18 C3.2 | v27.42,15.02 27.42,15.87 27.78,16.23 27.78,19.85 26.58,21.06 18.61,21.06 14.87,17.32 12.22,17.32 11.86,16.95 S1.4 11.73,16.83 9.92,15.02 6.79,15.02 4.92,16.89
SPI1_MISO  (via drill 0.3)
  Top 0.305: v29.95,8.15 29.47,8.63 29.47,9.35 U1.12 | JP4.5 43.71,16.23 37.55,16.23 U6.6
  Bottom 0.305: v29.95,8.15 31.16,8.15 33.09,10.08 36.83,10.08 36.95,9.96 37.92,9.96 38.64,10.68 38.64,15.02 37.55,16.11 U6.6
SPI1_MOSI  (via drill 0.3)
  Top 0.305: v31.28,19.61 30.32,18.64 30.32,17.92 U1.28 | v32.49,20.45 32.49,20.21 33.81,18.88 v33.81,17.32 | JP4.4 43.83,18.64 45.76,16.71 45.76,15.75 44.79,14.78 38.64,14.78 37.55,13.7 U6.5
  Bottom 0.305: v31.28,19.61 31.64,19.61 v32.49,20.45 | v33.81,17.32 33.81,16.71 36.83,13.7 37.43,13.7 U6.5
SPI1_NSS  (via drill 0.3)
  Top 0.305: v27.9,5.98 27.9,9.35 U1.10 | v22.11,2.6 24.77,2.6 v25.37,1.99
  Bottom 0.305: 22.11,2.72 23.44,2.72 SJ2.2 | 22.11,2.72 19.7,2.72 SJ1.2 | v27.9,5.98 27.9,5.61 30.68,2.84 31.04,2.84 SJ4.2 | SJ4.2 30.68,2.72 30.68,1.99 30.07,1.39 29.59,1.39 28.26,2.72 27.42,2.72 SJ3.2 27.18,2.72 26.45,1.99 v25.37,1.99 | SJ5.2 34.9,2.72 31.16,2.72 SJ4.2 | v22.11,2.6 22.11,2.72
SPI1_SCK  (via drill 0.3)
  Top 0.305: v32.73,15.87 31.88,16.71 31.88,17.8 U1.26 | v40.09,13.21 39.6,13.21 37.55,11.16 U6.4
  Bottom 0.305: v32.73,15.87 37.43,11.16 U6.4 | v40.09,13.21 40.09,17.32 43.71,20.94 43.71,21.18 JP4.3
SWCLK  (via drill 0.3)
  Top 0.305: v32.49,21.42 34.54,19.37 34.54,16.95 34.05,16.47 U1.24 | v30.92,23.59 v30.92,22.14 | v23.56,23.59 15.72,15.75 15.72,13.09 14.87,12.25 14.15,12.25 12.94,11.04 12.94,9.23 11.01,7.3 JP2.2
  Bottom 0.305: v32.49,21.42 31.64,21.42 v30.92,22.14 | v23.56,23.59 v30.92,23.59
SWDIO  (via drill 0.3)
  Top 0.305: v31.88,24.31 35.14,21.06 35.14,15.99 34.9,15.75 34.05,15.75 U1.23 | v5.1,18.4 5.1,14.3 3.29,12.49 JP2.4
  Bottom 0.305: v31.88,24.31 13.54,24.31 11.49,22.26 8.96,22.26 v5.1,18.4
UART2_RX  (via drill 0.3)
  Top 0.305: v31.76,23.47 31.76,20.21 32.61,19.37 32.61,17.92 U1.25 | v36.47,26.97 37.19,27.69 46.48,27.69 51.91,22.26 51.91,9.11 48.89,6.1 JP3.2
  Bottom 0.305: v31.76,23.47 32.97,23.47 v36.47,26.97
UART2_TX  (via drill 0.3)
  Top 0.305: v26.21,9.11 25.73,9.59 25.73,10.8 U1.8 | v36.35,5.25 36.59,5.25 37.19,4.65 38.28,4.65 38.52,4.41 v41.9,4.41
  Bottom 0.305: v26.21,9.11 27.66,9.11 31.52,5.25 v36.35,5.25 | v41.9,4.41 42.38,4.41 42.62,4.65 47.81,4.65 48.89,3.56 JP3.1
V_FLT1
  Top 0.305: U4.6 38.04,43.5 36.59,42.05 35.02,42.05 C8.1
V_FLT2
  Top 0.305: C9.1 19.58,47.12 18.01,47.12 16.56,48.56 15.96,48.56 U5.6
VDDA  (via drill 0.38)
  Top 0.381: v23.92,20.33 21.99,20.33 L1.1 | v24.28,13.82 24.77,13.34 25.61,13.34 U1.5
  Bottom 0.381: v23.92,20.33 24.89,19.37 C4.1 24.77,19.25 24.28,18.76 v24.28,13.82

### Text on the board
tPlace: JP7 | GND | +12V | A | A
bPlace: MOTOR P | MOTOR N | GND | 3V3 | ENC_CH-A | ENC_CH-B | MOTOR P | MOTOR N | GND | 3V3 | ENC_CH-A | ENC_CH-B | GND | GND | MOTOR_PWR | +12V | 3V3 | v.1.0. | SCK | NC | MOSI | NRST | MISO | SWDIO | GP0 | G | GP1 | GP2 | SWCLK | 3V3 | GP4 | RX | GP5 | TX | 0 | 1 | 2 | 4 | 5 | SPI_SS